# EAGLE schematic URC-LCD (EAGLE 9.6.2)
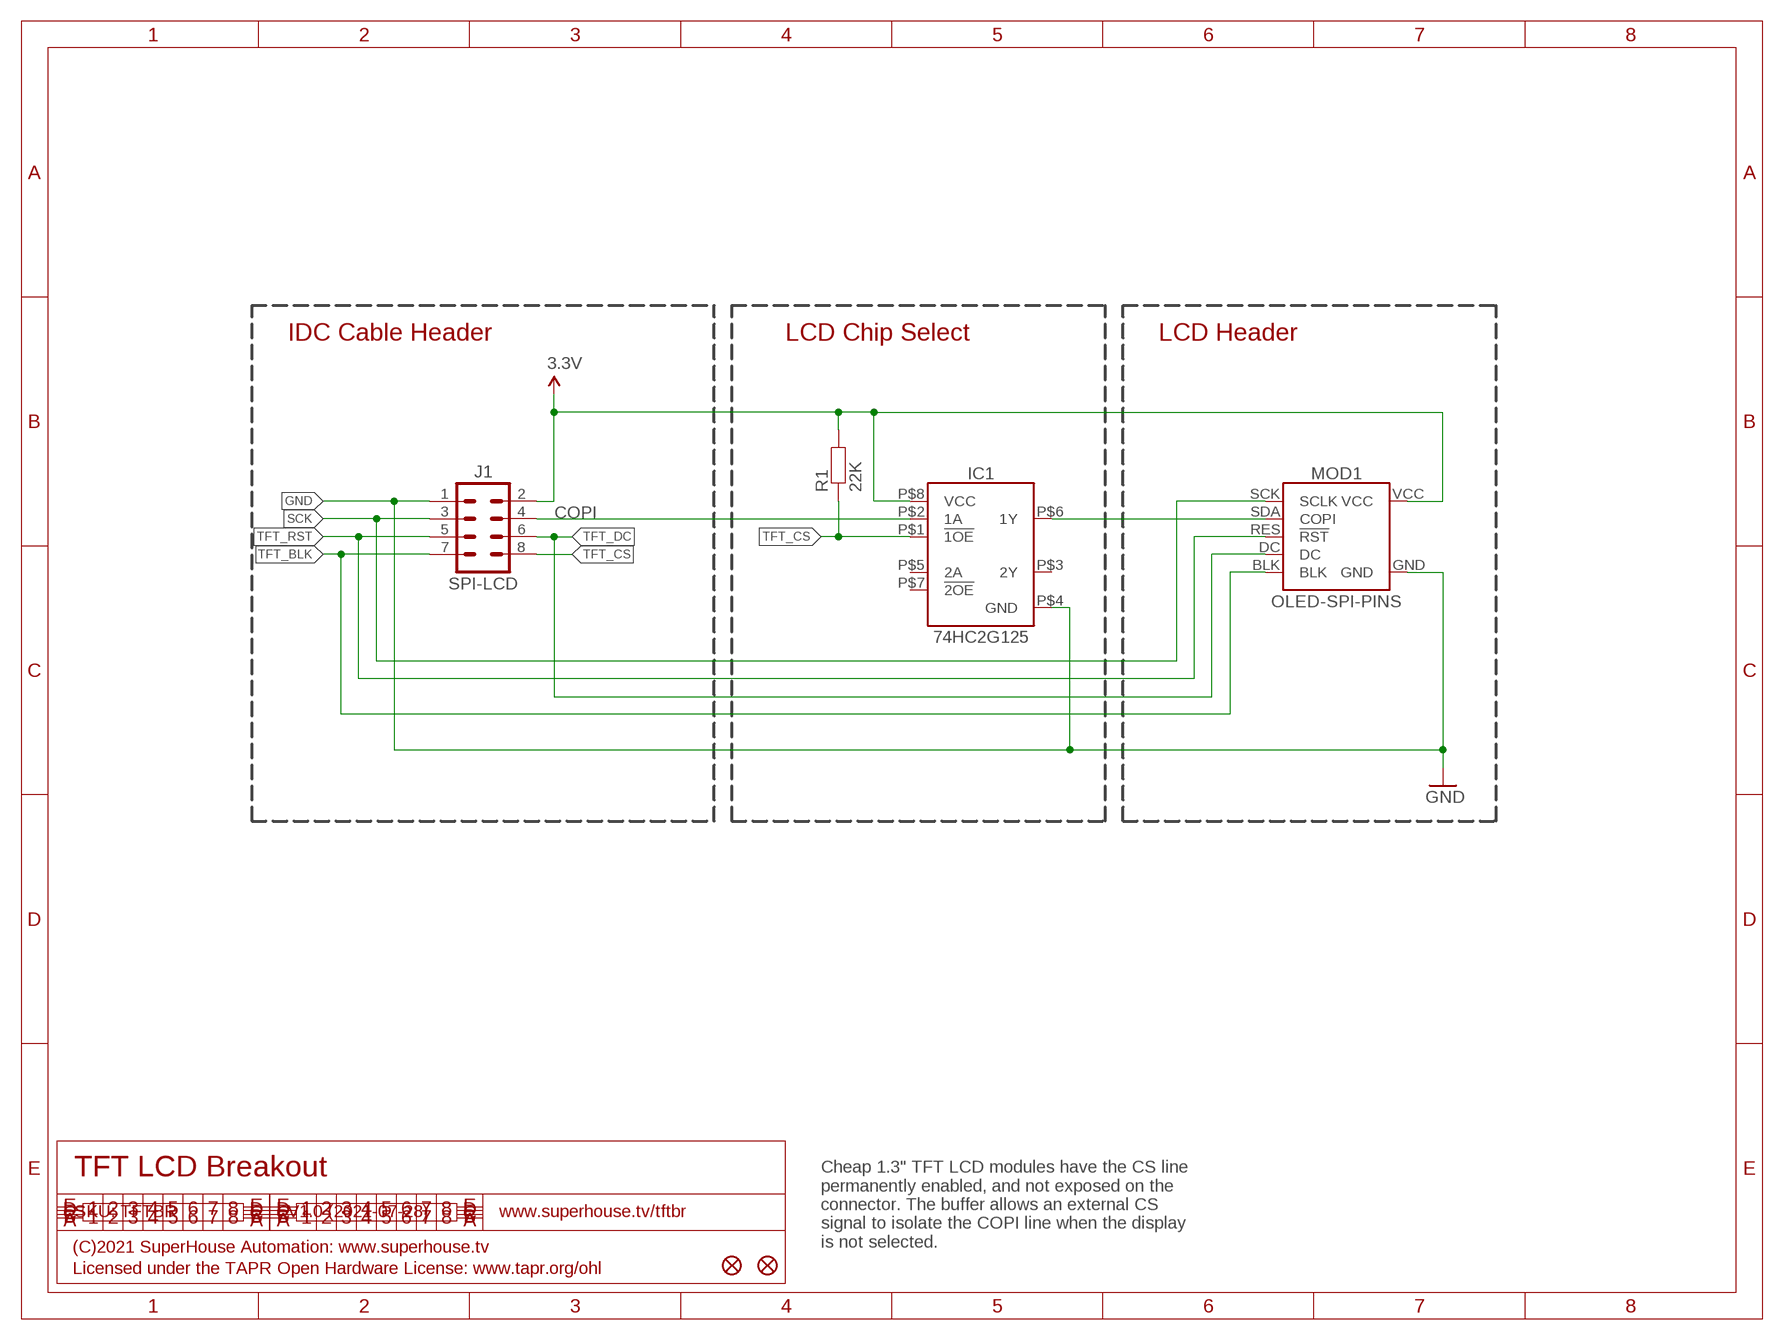
[diagram p0: schematic, sheet 1]

## Parts
FID1  FIDUCIAL1X2.5  [FIDUCIAL-1X2.5]
FID3  FIDUCIAL1X2.5  [FIDUCIAL-1X2.5]
IC1  74HC2G125  74HC2G125-TSSOP8  [74HC2G125]
J1  SPI-LCD  M02X4-SHROUD  [2X04-2.54-SHROUDED]
MOD1  OLED-SPI-PINS  [OLED-240X240-1.3]
R1  22K  RESISTOR0603  [R0603]

## Nets
3.3V: IC1.P$8(VCC) J1.2 MOD1.VCC R1.2
COPI: IC1.P$2(1A) J1.4
GND: IC1.P$4(GND) J1.1 MOD1.GND
N$1: IC1.P$6(1Y) MOD1.SDA(COPI)
SCK: J1.3 MOD1.SCK(SCLK)
TFT_BLK: J1.7 MOD1.BLK
TFT_CS: IC1.P$1(!1OE) J1.8 R1.1
TFT_DC: J1.6 MOD1.DC
TFT_RST: J1.5 MOD1.RES(!RST)
Unconnected: IC1.P$3(2Y) IC1.P$5(2A) IC1.P$7(!2OE)

## Notes on the sheet
- IDC Cable Header | LCD Chip Select | LCD Header
- TFT LCD Breakout
- SKU: TFTBR | V1.0 (2021-07-28) | www.superhouse.tv/tftbr
- Cheap 1.3" TFT LCD modules have the CS line
  permanently enabled, and not exposed on the
  connector. The buffer allows an external CS
  signal to isolate the COPI line when the display
  is not selected.
- (C)2021 SuperHouse Automation: www.superhouse.tv
- Licensed under the TAPR Open Hardware License: www.tapr.org/ohl

## Library data of the parts
FID1 FID3 = SuperHouse-Symbols:FIDUCIAL: Fiducial Alignment Points Various fiducial points for machine vision alignment.
IC1 = SuperHouse-ICs:74HC2G125: 74HC2G125 tri-state dual buffer
J1 = SuperHouse-Connectors:M02X4: M08 header in 2x4 format
MOD1 = SuperHouse-Displays:OLED-SPI
R1 = SuperHouse-Resistors:RESISTOR: Resistors in both surface-mount and through-hole versions.